# Altium schematic sheet myLEDBlinker.SchDoc: LED Blinker
size Letter; DrawnBy: Bud Wandinger; Revision: 1
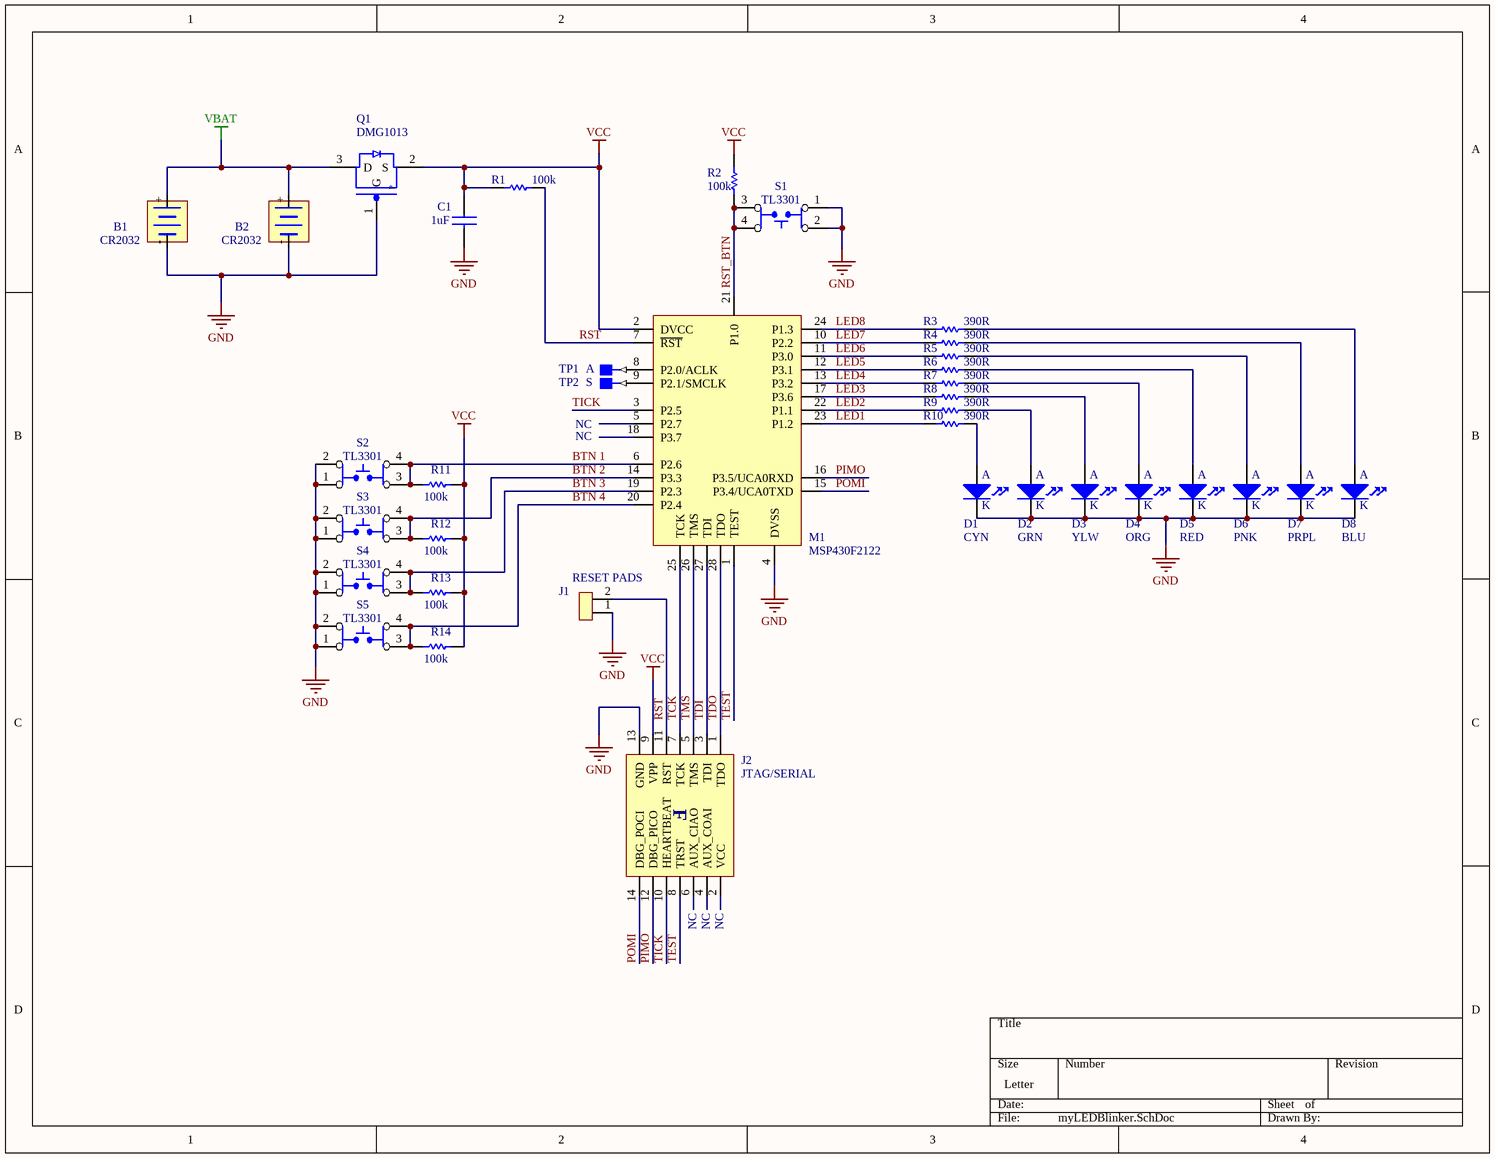
[diagram p0: myLEDBlinker.SchDoc]

## Parts
B1  CR2032  [CONN BATTERY HOLDER CR2032]
B2  CR2032  [CONN BATTERY HOLDER CR2032]
C1  1uF  [0603]
D1  CYN  [PLCC-2 AK]
D2  GRN  [PLCC-2 AK]
D3  YLW  [PLCC-2 AK]
D4  ORG  [PLCC-2 AK]
D5  RED  [PLCC-2 AK]
D6  PNK  [PLCC-2 AK]
D7  PRPL  [PLCC-2 AK]
D8  BLU  [PLCC-2 AK]
J1  RESET PADS  [HDR1X2]
J2  JTAG/SERIAL  [CONN 14POS 7X2 SMT FEMALE SMALL]
M1  MSP430F2122  [TSSOP28]
Q1  DMG1013  [SC-70-3]
R1  100k  [0603]
R2  100k  [0603]
R3  390R  [0603]
R4  390R  [0603]
R5  390R  [0603]
R6  390R  [0603]
R7  390R  [0603]
R8  390R  [0603]
R9  390R  [0603]
R10  390R  [0603]
R11  100k  [0603]
R12  100k  [0603]
R13  100k  [0603]
R14  100k  [0603]
S1  TL3301  [SWITCH TACT SMT TL3301]
S2  TL3301  [SWITCH TACT SMT TL3301]
S3  TL3301  [SWITCH TACT SMT TL3301]
S4  TL3301  [SWITCH TACT SMT TL3301]
S5  TL3301  [SWITCH TACT SMT TL3301]
TP1  A  [TEST POINT SMT]  (no BOM)
TP2  S  [TEST POINT SMT]  (no BOM)

## Nets
GND: B1.- B2.- C1.2 D1.K D2.K D3.K D4.K D5.K D6.K D7.K D8.K J1.1 J2.13(GND) M1.4(DVSS) Q1.1(G) S1.1(X1) S1.2(X2) S2.1(X1) S2.2(X2) S3.1(X1) S3.2(X2) S4.1(X1) S4.2(X2) S5.1(X1) S5.2(X2)
VBAT: B1.+ B2.+ Q1.3(D)
VCC: C1.1 J2.9(VPP) M1.2(DVCC) Q1.2(S) R1.1 R2.2 R11.2 R12.2 R13.2 R14.2
BTN 1: M1.6(P2.6) R11.1 S2.3(Y1) S2.4(Y2)
BTN 2: M1.14(P3.3) R12.1 S3.3(Y1) S3.4(Y2)
BTN 3: M1.19(P2.3) R13.1 S4.3(Y1) S4.4(Y2)
BTN 4: M1.20(P2.4) R14.1 S5.3(Y1) S5.4(Y2)
LED1: M1.23(P1.2) R10.1
LED2: M1.22(P1.1) R9.1
LED3: M1.17(P3.6) R8.1
LED4: M1.13(P3.2) R7.1
LED5: M1.12(P3.1) R6.1
LED6: M1.11(P3.0) R5.1
LED7: M1.10(P2.2) R4.1
LED8: M1.24(P1.3) R3.1
PIMO: J2.12(DBG_PICO) M1.16(P3.5/UCA0RXD)
POMI: J2.14(DBG_POCI) M1.15(P3.4/UCA0TXD)
RST: J1.2 J2.11(RST) M1.7(~{RST}) R1.2
RST_BTN: M1.21(P1.0) R2.1 S1.3(Y1) S1.4(Y2)
TCK: J2.7(TCK) M1.25(TCK)
TDI: J2.3(TDI) M1.27(TDI)
TDO: J2.1(TDO) M1.28(TDO)
TEST: J2.8(TRST) M1.1(TEST)
TICK: J2.10(HEARTBEAT) M1.3(P2.5)
TMS: J2.5(TMS) M1.26(TMS)
NetD1_A: D1.A R10.2
NetD2_A: D2.A R9.2
NetD3_A: D3.A R8.2
NetD4_A: D4.A R7.2
NetD5_A: D5.A R6.2
NetD6_A: D6.A R5.2
NetD7_A: D7.A R4.2
NetD8_A: D8.A R3.2
NetM1_8: M1.8(P2.0/ACLK) TP1.1
NetM1_9: M1.9(P2.1/SMCLK) TP2.1

Not connected (* = marked no-connect by the designer): J2 2(VCC) 4(AUX_COAI) 6(AUX_CIAO); M1 5(P2.7) 18(P3.7)

## Notes on the sheet
- NC
- (near J2) NC
- (in symbol CONN JTAG/SERIAL FEMALE) F
- (in symbol TRANS PMOS 1G 2S 3D) P

## Library data of the parts
B1 B2 = CONN BATTERY HOLDER CR2032: 3V Coincell Battery; 2. Manufacturer: FCI; 3. Manufacturer Part Number: BK-912; 5. Internal Part Number: 100192; 1. Description: CONN HOLDER COIN CELL 20MM SMD; 7. Modified By: JRL; 4. Digi-Key Part Number: BK-912-ND; 6. Last Modified: 2012-09-03
C1 = CAPACITOR NON-POLARIZED: 3. Manufacturer Part Number: EMK107BJ105KA-T; 2. Manufacturer: Taiyo; 1. Description: CAP CER 1uF 10% X5R 16V 0603 SMT; 7. Modified By: BJW; 5. Internal Part Number: *; 4. Digi-Key Part Number: 587-1251-2-ND; 6. Last Modified: 2018-11-10
D1 = LED AK: CYAN; 2. Manufacturer: KingBright; 1. Description: LED PLCC2 CYAN ROUND CLEAR SMD; 7. Modified By: BJW; 3. Manufacturer Part Number: *; 4. Digi-Key Part Number: *; 5. Internal Part Number: *; 6. Last Modified: 2018-11-10
D2 = LED AK: GREEN; 2. Manufacturer: KingBright; 3. Manufacturer Part Number: AA3528CGSK; 1. Description: LED PLCC2 GREEN ROUND CLEAR SMD; 7. Modified By: BJW; 4. Digi-Key Part Number: 754-1528-2-ND; 5. Internal Part Number: *; 6. Last Modified: 2018-11-10
D3 = LED AK: YELLOW; 2. Manufacturer: KingBright; 3. Manufacturer Part Number: AA3528SYCK; 1. Description: LED PLCC2 YELLOW ROUND CLEAR SMD; 7. Modified By: BJW; 4. Digi-Key Part Number: 754-2077-2-ND; 5. Internal Part Number: *; 6. Last Modified: 2018-11-10
D4 = LED AK: ORANGE; 2. Manufacturer: KingBright; 3. Manufacturer Part Number: AA3528SESK; 1. Description: LED PLCC2 ORANGE ROUND CLEAR SMD; 7. Modified By: BJW; 4. Digi-Key Part Number: 754-1536-2-ND; 5. Internal Part Number: *; 6. Last Modified: 2018-11-10
D5 = LED AK: 2. Manufacturer: KingBright; 3. Manufacturer Part Number: AA3528SURSK; 1. Description: LED PLCC2 RED ROUND CLEAR SMD; 7. Modified By: BJW; 4. Digi-Key Part Number: 754-1537-2-ND; 5. Internal Part Number: *; 6. Last Modified: 2018-11-10
D6 = LED AK: PINK; 2. Manufacturer: KingBright; 3. Manufacturer Part Number: AA3528VRVCS/A; 1. Description: LED PLCC2 PINK ROUND CLEAR SMD; 7. Modified By: BJW; 4. Digi-Key Part Number: 754-1534-2-ND; 5. Internal Part Number: *; 6. Last Modified: 2018-11-10
D7 = LED AK: PURPLE; 2. Manufacturer: KingBright; 3. Manufacturer Part Number: AA3528VRVFS/A; 1. Description: LED PLCC2 PURPLE ROUND CLEAR SMD; 7. Modified By: BJW; 4. Digi-Key Part Number: 754-1535-2-ND; 5. Internal Part Number: *; 6. Last Modified: 2018-11-10
D8 = LED AK: BLUE; 2. Manufacturer: KingBright; 3. Manufacturer Part Number: AA3528QBS/D; 1. Description: LED PLCC2 BLUE ROUND CLEAR SMD; 7. Modified By: BJW; 4. Digi-Key Part Number: 754-1533-2-ND; 5. Internal Part Number: *; 6. Last Modified: 2018-11-10
J1 = CONN SIP 2: 2. Manufacturer: *; 3. Manufacturer Part Number: *; 1. Description: *; 4. Digi-Key Part Number: *; 5. Internal Part Number: *; 6. Last Modified: *; 7. Modified By: *
J2 = CONN JTAG/SERIAL FEMALE: 2. Manufacturer: FCI; 3. Manufacturer Part Number: 20021321-00014T4LF; 5. Internal Part Number: 100254; 1. Description: CONN TERMINAL 14POS 7X12 1.27MM VERT SMD; 7. Modified By: BJW; 4. Digi-Key Part Number: 609-3771-ND; 6. Last Modified: 2018-10-07
M1 = MCU MSP430F2122 TSSOP28: 2. Manufacturer: TI; 3. Manufacturer Part Number: MSP430F2122TPWR; 1. Description: MCU MSP430F2122 TSSOP28 LED BLINKER; 7. Modified By: BJW; 4. Digi-Key Part Number: 296-23365-ND; 5. Internal Part Number: *; 6. Last Modified: 2018-10-07
Q1 = TRANS PMOS 1G 2S 3D: 2. Manufacturer: Diodes Incorporated; 3. Manufacturer Part Number: DMG1013UW-7; 1. Description: TRANS PMOS 20V 820MA SOT323; 7. Modified By: BJW; 4. Digi-Key Part Number: DMG1013UW-7DITR-ND; 5. Internal Part Number: *; 6. Last Modified: 2018-11-10
R1 R2 R11-R14 = RESISTOR: 2. Manufacturer: Yageo; 3. Manufacturer Part Number: RC0603FR-07100KL; 1. Description: RES 100K OHM 1/10W 1% 0603 SMD; 7. Modified By: BJW; 5. Internal Part Number: *; 4. Digi-Key Part Number: 311-100KHRTR-ND; 6. Last Modified: 2018-11-10
R3-R10 = RESISTOR: 2. Manufacturer: Yageo; 3. Manufacturer Part Number: RC0603FR-07390RL; 1. Description: RES 390 OHM 1/10W 1% 0603; 7. Modified By: BJW; 5. Internal Part Number: *; 4. Digi-Key Part Number: 311-390HRTR-ND; 6. Last Modified: 2018-11-10
S1-S5 = SWITCH SPST TL3301 JLEAD: SPST TACT SWITCH; 2. Manufacturer: E-Switch; 3. Manufacturer Part Number: TL3301AF160QJ; 1. Description: SWITCH TACT 260GF H=5.0MM SMT; 7. Modified By: BJW; 4. Digi-key Part Number: EG4374TR-ND; 6. Last Modified: 2018-11-10
TP1 TP2 = TEST POINT SMT: 1. Description: Test pad; 7. Modified By: JRL; 2. Manufacturer: N/A; 3. Manufacturer Part Number: N/A; 4. Digi-key Part Number: N/A; 5. Internal Part Number: N/A; 6. Last Modified: June 12, 2008